# Altium project Three_phase_buck_converter_battery_charger.PrjPcb
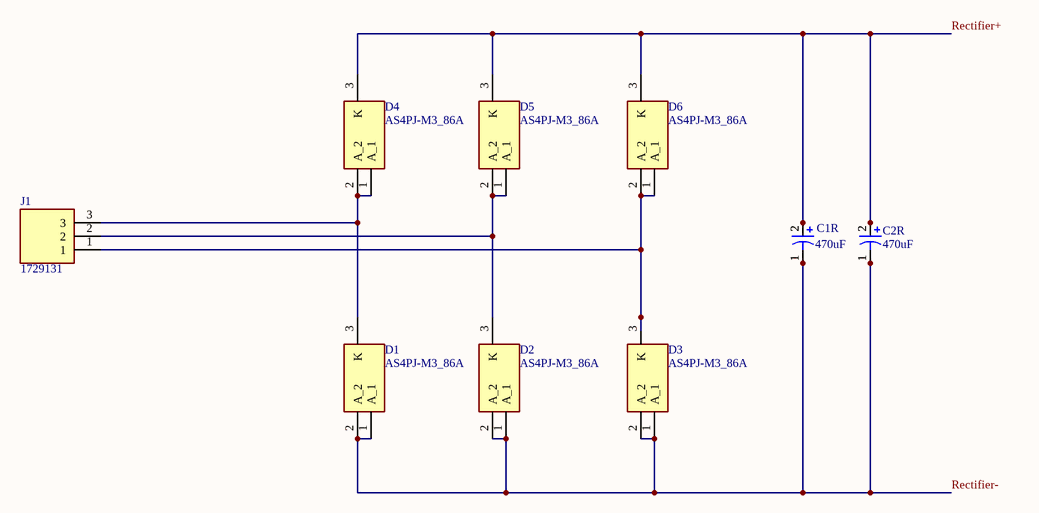
[diagram p0: Rectifier.SchDoc]
3 sheets, 36 parts. Net scope: global (net labels, ports and power ports of the same name join across sheets).
Board file: PCB1.PcbDoc
Sheets:
  Rectifier.SchDoc
  Converter.SchDoc
  Controller.SchDoc

## Sheet Rectifier.SchDoc
size A4

### Parts
C1R  470uF  [450MXH270MEFCSN30X30]
C2R  470uF  [450MXH270MEFCSN30X30]
D1  AS4PJ-M3_86A  [V10PN50M387A]
D2  AS4PJ-M3_86A  [V10PN50M387A]
D3  AS4PJ-M3_86A  [V10PN50M387A]
D4  AS4PJ-M3_86A  [V10PN50M387A]
D5  AS4PJ-M3_86A  [V10PN50M387A]
D6  AS4PJ-M3_86A  [V10PN50M387A]
J1  1729131  [1729131]

### Nets
Rectifier-: C1R.1(-) C2R.1(-) D1.1(A_1) D1.2(A_2) D2.1(A_1) D2.2(A_2) D3.1(A_1) D3.2(A_2)
Rectifier+: C1R.2(+) C2R.2(+) D4.3(K) D5.3(K) D6.3(K)
NetD1_3: D1.3(K) D4.1(A_1) D4.2(A_2) J1.3
NetD2_3: D2.3(K) D5.1(A_1) D5.2(A_2) J1.2
NetD3_3: D3.3(K) D6.1(A_1) D6.2(A_2) J1.1

### Library data of the parts
C1R C2R = 450MXH270MEFCSN30X30
D1-D6 = AS4PJ-M3_86A: Diode; Manufacturer_Name: Vishay; Manufacturer_Part_Number: AS4PJ-M3/86A; Datasheet Link: http://www.vishay.com/docs/88770/as4pd.pdf; Height: 1.2mm; Mouser Part Number: 625-AS4PJ-M3/86A; Mouser Price/Stock: https://www.mouser.co.uk/ProductDetail/Vishay-Semiconductors/AS4PJ-M3-86A?qs=z5NHsHGj0DEO4GI4Od5axw%3D%3D; Arrow Part Number: AS4PJ-M3/86A; Arrow Price/Stock: https://www.arrow.com/en/products/as4pj-m386a/vishay
J1 = 1729131: Connector; Manufacturer_Name: Phoenix Contact; Datasheet Link: https://componentsearchengine.com/Datasheets/2/1729131.pdf; Height: 10.15mm; Manufacturer_Part_Number: 1729131; Mouser Part Number: 651-1729131; Mouser Price/Stock: https://www.mouser.co.uk/ProductDetail/Phoenix-Contact/1729131/?qs=GFUSqQMLmmkspw%2F%2FW6PC3g%3D%3D

## Sheet Converter.SchDoc
size A4
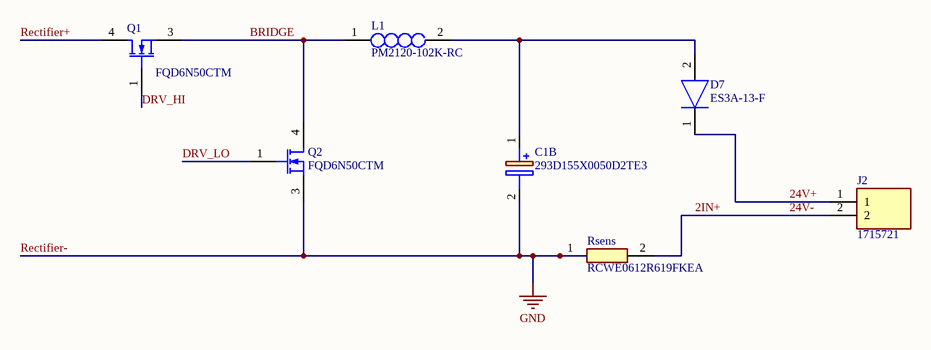
[diagram p1: Converter.SchDoc]

### Parts
C1B  293D155X0050D2TE3  [CAPPM7343X310N]
D7  ES3A-13-F  [DIOM7959X250N]
J2  1715721  [1715721]
L1  PM2120-102K-RC  [PM2120271KRC]
Q1  FQD6N50CTM  [DPAK3]
Q2  FQD6N50CTM  [DPAK3]
Rsens  RCWE0612R619FKEA  [RESC1632X70N]

### Nets
Rectifier-: C1B.2(-) Q2.3(S) Rsens.1  [also labelled GND]
24V+: D7.1(K) J2.1
24V-: J2.2 Rsens.2  [also labelled 2IN+]
BRIDGE: L1.1 Q1.3(S) Q2.4(D)
DRV_HI: Q1.1(G)
DRV_LO: Q2.1(G)
Rectifier+: Q1.4(D)
NetC1B_1: C1B.1(+) D7.2(A) L1.2

### Library data of the parts
C1B = 293D155X0050D2TE3: Capacitor Polarised; Manufacturer_Name: Vishay; Datasheet Link: http://www.vishay.com/doc?40002; Height: 3.1mm; Manufacturer_Part_Number: 293D155X0050D2TE3; Mouser Part Number: N/A; Mouser Price/Stock: https://www.mouser.co.uk/ProductDetail/Vishay-Sprague/293D155X0050D2TE3/?qs=dG4nGvFc7P9fHhfu7ckfoQ%3D%3D
D7 = ES3A-13-F: Diode; Manufacturer_Name: Diodes Inc.; Datasheet Link: https://www.arrow.com/en/products/es3a-13-f/diodes-incorporated; Height: 2.5mm; Manufacturer_Part_Number: ES3A-13-F; Mouser Part Number: 621-ES3A-F; Mouser Price/Stock: https://www.mouser.co.uk/ProductDetail/Diodes-Incorporated/ES3A-13-F/?qs=fsGQ151tk6Wkygd1WaXOlQ%3D%3D; Arrow Part Number: ES3A-13-F; Arrow Price/Stock: https://www.arrow.com/en/products/es3a-13-f/diodes-incorporated
J2 = 1715721: Connector; Manufacturer_Name: Phoenix Contact; Datasheet Link: https://componentsearchengine.com/Datasheets/2/1715721.pdf; Height: 13.95mm; Manufacturer_Part_Number: 1715721; Mouser Part Number: 651-1715721; Mouser Price/Stock: https://www.mouser.co.uk/ProductDetail/Phoenix-Contact/1715721/?qs=BYlwlsDsB%2FqgmKyTCSucHg%3D%3D; Arrow Part Number: 1715721; Arrow Price/Stock: https://www.arrow.com/en/products/1715721/phoenix-contact
L1 = PM2120-102K-RC: Inductor; Manufacturer_Name: Bourns; Datasheet Link: https://www.bourns.com/pdfs/pm2120_series.pdf; Height: 20.32mm; Manufacturer_Part_Number: PM2120-102K-RC
Q1 Q2 = FQD6N50CTM: Transistor, Mosfet, N-Channel, 500V V(Br)Dss, 4.5A I(D), To-252Aa; Manufacturer: ON Semiconductor / Fairchild; Rise Time: 35ns; Rds On Max: 1.2R; Input Capacitance: 700pF; Fall Time: 45ns; Power Dissipation: 2.5W; Turn-Off Delay Time: 55ns; Gate to Source Voltage (Vgs): 30V; Element Configuration: Single; Turn-On Delay Time: 10ns; Number of Elements: 1; Supplier 1: Digi-Key; Manufacturer Part Number: FQD6N50CTM; RoHS: Yes; Category: MOSFETs; Stock 1: 650; Pricing 1: 1=0,95000, 10=0,77600, 25=0,76200, 100=0,60380, 500=0,51176, 1000=0,41688 (USD); Mount: Surface Mount; Case/Package: DPAK; Number of Pins: 3; Weight: 0.26037g; Min Operating Temperature: -55°C; Max Operating Temperature: 150°C; Package Quantity: 1; Packaging: Tape and Reel; Continuous Drain Current (ID): 4.5A; Drain to Source Breakdown Voltage: 500V; Drain to Source Resistance: 1.2R; Drain to Source Voltage (Vdss): 500V; Max Power Dissipation: 2.5W; Voltage Rating (DC): 500V; Current Rating: 4.5A; Radiation Hardening: No; Lead Free: Lead Free; ComponentLink1URL: https://datasheet.ciiva.com/11175/fqd6n50c-11175856.pdf?src-supplier=Avnet; ComponentLink1Description: https://datasheet.ciiva.com/11175/fqd6n50c-11175856.pdf?src-supplier=Avnet; ComponentLink2URL: https://datasheet.ciiva.com/4445/fqd6n50c-110706-4445904.pdf?src-supplier=Mouser; ComponentLink2Description: https://datasheet.ciiva.com/4445/fqd6n50c-110706-4445904.pdf?src-supplier=Mouser; ComponentLink3URL: https://datasheet.ciiva.com/26791/fqd6n50ctm-26791044.pdf?src-supplier=IIIC; ComponentLink3Description: https://datasheet.ciiva.com/26791/fqd6n50ctm-26791044.pdf?src-supplier=IIIC; Supplier Part Number 1: FQD6N50CTMCT-ND
Rsens = RCWE0612R619FKEA: Resistor; Manufacturer_Name: Vishay; Datasheet Link: https://componentsearchengine.com/Datasheets/2/RCWE0612R619FKEA.pdf; Height: 0.7mm; Manufacturer_Part_Number: RCWE0612R619FKEA; Mouser Part Number: 71-RCWE0612R619FKEA; Mouser Price/Stock: https://www.mouser.co.uk/ProductDetail/Vishay-Dale/RCWE0612R619FKEA/?qs=bvCpHSZmQjl4FfGNZ007qQ%3D%3D; Arrow Part Number: RCWE0612R619FKEA; Arrow Price/Stock: https://www.arrow.com/en/products/rcwe0612r619fkea/vishay

## Sheet Controller.SchDoc
size A4
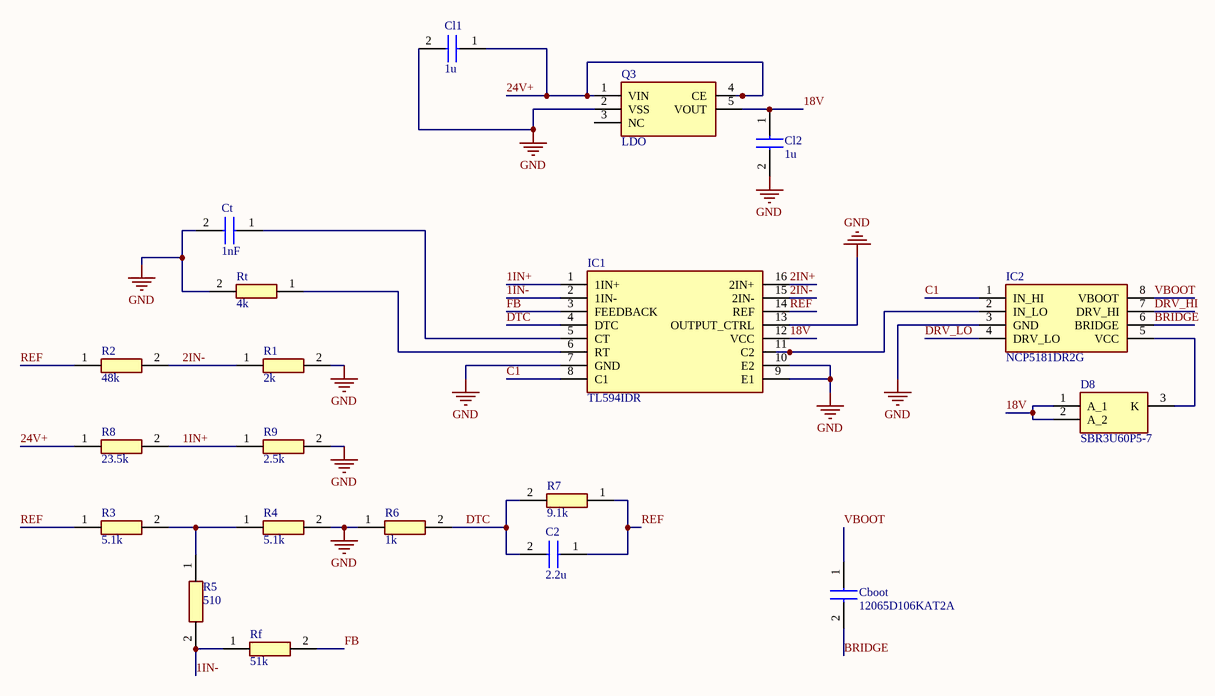
[diagram p2: Controller.SchDoc]

### Parts
C2  2.2u  [CAPC1005X55N]
Cboot  12065D106KAT2A  [CAPC3216X229N]
Cl1  1u  [CAPC3225X105N]
Cl2  1u  [CAPC3225X105N]
Ct  1nF  [CAPC1608X90N]
D8  SBR3U60P5-7  [SBR3U60P57]
IC1  TL594IDR  [SOIC127P600X175-16N]
IC2  NCP5181DR2G  [SOIC127P600X175-8N]
Q3  LDO  [SOT95P280X120-5N]
R1  2k  [RESC1608X55N]
R2  48k  [RESC2012X65N]
R3  5.1k  [RESC1005X40N]
R4  5.1k  [RESC1005X40N]
R5  510  [RESC1608X50N]
R6  1k  [RESC1608X55N]
R7  9.1k  [RESC1005X40N]
R8  23.5k  [RESC1608X55N]
R9  2.5k  [RESC2012X60N]
Rf  51k  [RESC1005X40N]
Rt  4k  [RESC1608X55N]

### Nets
GND: Cl1.2 Cl2.2 Ct.2 IC1.7(GND) IC1.9(E1) IC1.10(E2) IC1.13(OUTPUT_CTRL) IC2.3(GND) Q3.2(VSS) R1.2 R4.2 R6.1 R9.2 Rt.2  [project net Rectifier-]
1IN+: IC1.1(1IN+) R8.2 R9.1
1IN-: IC1.2(1IN-) R5.2 Rf.1
2IN+: IC1.16(2IN+)  [project net 24V-]
2IN-: IC1.15(2IN-) R1.1 R2.2
18V: Cl2.1 D8.1(A_1) D8.2(A_2) IC1.12(VCC) Q3.5(VOUT)
24V+: Cl1.1 Q3.1(VIN) Q3.4(CE) R8.1
BRIDGE: Cboot.2 IC2.6(BRIDGE)
C1: IC1.8(C1) IC2.1(IN_HI)
DRV_HI: IC2.7(DRV_HI)
DRV_LO: IC2.4(DRV_LO)
DTC: C2.2 IC1.4(DTC) R6.2 R7.2
FB: IC1.3(FEEDBACK) Rf.2
REF: C2.1 IC1.14(REF) R2.1 R3.1 R7.1
VBOOT: Cboot.1 IC2.8(VBOOT)
NetCt_1: Ct.1 IC1.5(CT)
NetD8_3: D8.3(K) IC2.5(VCC)
NetIC1_6: IC1.6(RT) Rt.1
NetIC1_11: IC1.11(C2) IC2.2(IN_LO)
NetR3_2: R3.2 R4.1 R5.1

Not connected (* = marked no-connect by the designer): Q3 3(NC)

### Library data of the parts
C2 = C0402C225K9PACTU: Capacitor; Manufacturer_Name: Kemet; Datasheet Link: https://content.kemet.com/datasheets/KEM_C1002_X7R_SMD.pdf; Height: 0.55mm; Manufacturer_Part_Number: C0402C225K9PACTU; Mouser Part Number: 80-C0402C225K9P; Mouser Price/Stock: https://www.mouser.co.uk/ProductDetail/KEMET/C0402C225K9PACTU/?qs=7hO1d5R1VgvbvfUaNq9%252BYQ%3D%3D; Arrow Part Number: C0402C225K9PACTU; Arrow Price/Stock: https://www.arrow.com/en/products/c0402c225k9pactu/kemet-corporation
Cboot = 12065D106KAT2A: Capacitor; Manufacturer_Name: AVX; Datasheet Link: http://datasheets.avx.com/cx5r.pdf; Height: 2.29mm; Manufacturer_Part_Number: 12065D106KAT2A; Mouser Part Number: 581-12065D106KAT2A; Mouser Price/Stock: https://www.mouser.co.uk/ProductDetail/AVX/12065D106KAT2A?qs=KdTYp8tcPglFZs244%2FIMaw%3D%3D; Arrow Part Number: 12065D106KAT2A; Arrow Price/Stock: https://www.arrow.com/en/products/12065d106kat2a/avx
Cl1 Cl2 = 885012209047: Capacitor; Manufacturer_Name: Wurth Elektronik; Datasheet Link: https://katalog.we-online.com/pbs/datasheet/885012209047.pdf; Height: 1.05mm; Manufacturer_Part_Number: 885012209047; Mouser Part Number: 710-885012209047; Mouser Price/Stock: https://www.mouser.co.uk/ProductDetail/Wurth-Elektronik/885012209047/?qs=0KOYDY2FL29YEbVS2nM5KQ%3D%3D
Ct = 06031C102KAZ2A: Capacitor; Manufacturer_Name: AVX; Datasheet Link: https://componentsearchengine.com/Datasheets/1/06031A100FAT2A.pdf; Height: 0.9mm; Manufacturer_Part_Number: 06031C102KAZ2A; Mouser Part Number: 581-06031C102KAZ2A; Mouser Price/Stock: https://www.mouser.co.uk/ProductDetail/AVX/06031C102KAZ2A?qs=ahudlVbFbatc7%2FoXGMS0PQ%3D%3D
D8 = SBR3U60P5-7: Schottky Diode; Manufacturer_Name: Diodes Inc.; Datasheet Link: https://www.mouser.com/datasheet/2/115/SBR3U60P5-941054.pdf; Height: 1.1mm; Manufacturer_Part_Number: SBR3U60P5-7; Mouser Part Number: 621-SBR3U60P5-7; Mouser Price/Stock: https://www.mouser.co.uk/ProductDetail/Diodes-Incorporated/SBR3U60P5-7/?qs=nJRy1mI8RR%252BxxKqfP%2FhEGg%3D%3D; Arrow Part Number: SBR3U60P5-7; Arrow Price/Stock: https://www.arrow.com/en/products/sbr3u60p5-7/diodes-incorporated
IC1 = TL594IDR: Integrated Circuit; Manufacturer_Name: Texas Instruments; Datasheet Link: http://www.ti.com/lit/gpn/TL594; Height: 1.75mm; Manufacturer_Part_Number: TL594IDR; Mouser Part Number: 595-TL594IDR; Mouser Price/Stock: https://www.mouser.co.uk/ProductDetail/Texas-Instruments/TL594IDR/?qs=odmYgEirbwx2xq08uKs%2FLA%3D%3D; Arrow Part Number: TL594IDR; Arrow Price/Stock: https://www.arrow.com/en/products/tl594idr/texas-instruments
IC2 = NCP5181DR2G: Integrated Circuit; Manufacturer_Name: ON Semiconductor; Datasheet Link: http://www.onsemi.com/pub/Collateral/NCP5181-D.PDF; Height: 1.75mm; Manufacturer_Part_Number: NCP5181DR2G; Mouser Part Number: 863-NCP5181DR2G; Mouser Price/Stock: https://www.mouser.co.uk/ProductDetail/ON-Semiconductor/NCP5181DR2G/?qs=OSf9jACorvZepnMsAKlxsQ%3D%3D; Arrow Part Number: NCP5181DR2G; Arrow Price/Stock: https://www.arrow.com/en/products/ncp5181dr2g/on-semiconductor
Q3 = XC6210B302MR-G: Transistor; Manufacturer_Name: Torex; Datasheet Link: https://componentsearchengine.com/Datasheets/1/XC6210B302MR-G.pdf; Height: 1.2mm; Manufacturer_Part_Number: XC6210B302MR-G; Mouser Part Number: 865-XC6210B302MR-G; Mouser Price/Stock: https://www.mouser.co.uk/ProductDetail/Torex-Semiconductor/XC6210B302MR-G?qs=AsjdqWjXhJ%2F8LVwdgROYaw%3D%3D
R1 R6 = RCA060310R0FKEAHP: Resistor; Manufacturer_Name: Vishay; Datasheet Link: https://www.vishay.com/docs/20067/rcahp.pdf; Height: 0.55mm; Manufacturer_Part_Number: RCA060310R0FKEAHP; Arrow Part Number: RCA060310R0FKEAHP; Arrow Price/Stock: https://www.arrow.com/en/products/rca060310r0fkeahp/vishay
R2 = CPF0805B49K9E1: Resistor; Manufacturer_Name: TE Connectivity; Datasheet Link: http://docs-europe.electrocomponents.com/webdocs/13d1/0900766b813d116f.pdf; Height: 0.65mm; Manufacturer_Part_Number: CPF0805B49K9E1; Mouser Part Number: 279-CPF0805B49K9E1; Mouser Price/Stock: https://www.mouser.co.uk/ProductDetail/TE-Connectivity-Holsworthy/CPF0805B49K9E1/?qs=iJVBkmKXgrkcN8Razl5GKw%3D%3D
R3 R4 = CRCW04025K10JNED: Resistor; Manufacturer_Name: Vishay; Datasheet Link: http://www.vishay.com/docs/20035/dcrcwe3.pdf; Height: 0.4mm; Manufacturer_Part_Number: CRCW04025K10JNED; Mouser Part Number: 71-CRCW0402J-5.1K-E3; Mouser Price/Stock: https://www.mouser.co.uk/ProductDetail/Vishay-Dale/CRCW04025K10JNED/?qs=DKbL89i6OEozZLVEbDGZhw%3D%3D; Arrow Part Number: CRCW04025K10JNED; Arrow Price/Stock: https://www.arrow.com/en/products/crcw04025k10jned/vishay
R5 = CRCW0603510RJNEA: Resistor; Manufacturer_Name: Vishay; Datasheet Link: http://www.vishay.com/docs/20035/dcrcwe3.pdf; Height: 0.5mm; Manufacturer_Part_Number: CRCW0603510RJNEA; Mouser Part Number: 71-CRCW0603J-510-E3; Mouser Price/Stock: https://www.mouser.co.uk/ProductDetail/Vishay-Dale/CRCW0603510RJNEA/?qs=F8Fiu5nZiPjhir5Uy48eTQ%3D%3D; Arrow Part Number: CRCW0603510RJNEA; Arrow Price/Stock: https://www.arrow.com/en/products/crcw0603510rjnea/vishay
R7 = CRCW04029K10JNED: Resistor; Manufacturer_Name: Vishay; Datasheet Link: http://www.vishay.com/docs/20035/dcrcwe3.pdf; Height: 0.4mm; Manufacturer_Part_Number: CRCW04029K10JNED; Mouser Part Number: 71-CRCW0402J-9.1K-E3; Mouser Price/Stock: https://www.mouser.co.uk/ProductDetail/Vishay-Dale/CRCW04029K10JNED/?qs=lxmYmG9KtX%2FHs4nfN6Hr1A%3D%3D
R8 Rt = MCT06030C2352FP500: Resistor; Manufacturer_Name: Vishay; Datasheet Link: http://www.vishay.com/docs/28705/mcx0x0xpro.pdf; Height: 0.55mm; Manufacturer_Part_Number: MCT06030C2352FP500; Mouser Part Number: N/A; Mouser Price/Stock: https://www.mouser.co.uk/ProductDetail/Vishay-Beyschlag/MCT06030C2352FP500/?qs=iuLH8FrUFAt7r3RaJxlO0Q%3D%3D
R9 = RN732ATTD2501B25: Resistor; Manufacturer_Name: KOA Speer; Datasheet Link: https://www.mouser.fr/datasheet/2/219/RN73-11994.pdf; Height: 0.6mm; Manufacturer_Part_Number: RN732ATTD2501B25; Mouser Part Number: 660-RN732ATTD2501B25; Mouser Price/Stock: https://www.mouser.co.uk/ProductDetail/KOA-Speer/RN732ATTD2501B25/?qs=PieNiMrGZlrhcfEc14mnog%3D%3D; Arrow Part Number: RN732ATTD2501B25; Arrow Price/Stock: https://www.arrow.com/en/products/rn732attd2501b25/koa-speer-electronics
Rf = MCMR04X5102FTL: Resistor; Manufacturer_Name: MULTICOMP; Datasheet Link: http://www.farnell.com/datasheets/1716707.pdf; Height: 0.4mm; Manufacturer_Part_Number: MCMR04X5102FTL

## Nets that join several sheets
Rectifier-: Rectifier (8 pins), Converter (C1B.2 Q2.3 Rsens.1), Controller (14 pins)
24V+: Converter (D7.1 J2.1), Controller (Cl1.1 Q3.1 Q3.4 R8.1)
24V-: Converter (J2.2 Rsens.2), Controller (IC1.16)
BRIDGE: Converter (L1.1 Q1.3 Q2.4), Controller (Cboot.2 IC2.6)
DRV_HI: Converter (Q1.1), Controller (IC2.7)
DRV_LO: Converter (Q2.1), Controller (IC2.4)
Rectifier+: Rectifier (5 pins), Converter (Q1.4)